# Altium schematic sheet POWER.SchDoc
size A4; SheetNumber: 4; SheetTotal: 7
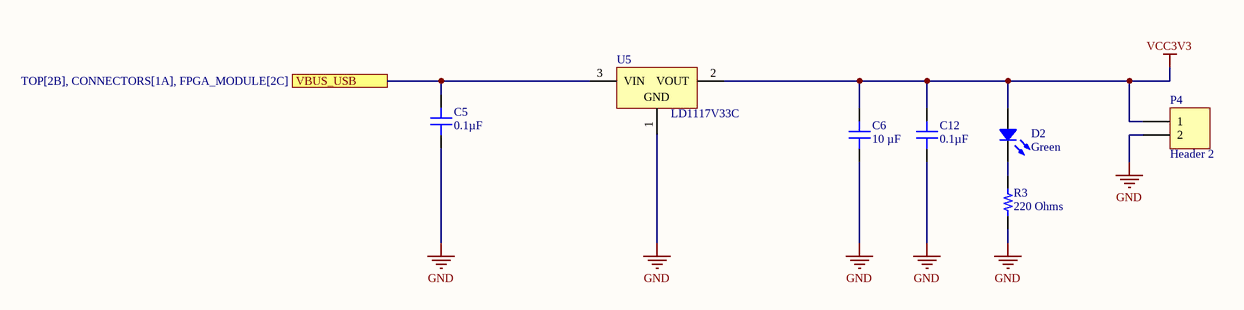
[diagram p0: POWER.SchDoc]

## Parts
C5  0.1µF  [CAP 0402_1005]
C6  10 µF  [CAP 1206_3216 - 0.8MM]
C12  0.1µF  [CAP 0402_1005]
D2  Green  [LED 1206_3216 GREEN]
P4  Header 2  [HDR1X2]
R3  220 Ohms  [RES 0402_1005]
U5  LD1117V33C  [TO220]

## Ports
VBUS_USB (see TOP[2B], CONNECTORS[1A], FPGA_MODULE[2C])

## Nets
GND: C5.1 C6.1 C12.1 P4.2 R3.1 U5.1(GND)
VCC3V3: C6.2 C12.2 D2.1 P4.1 U5.2(VOUT)
VBUS_USB: C5.2 U5.3(VIN) ; port VBUS_USB
NetD2_2: D2.2 R3.2

## Library data of the parts
C5 C12 = 0402ZC104KAT2A: CAP CER 0.1UF 10V X7R 0402; manufacturer: AVX Corporation; Tolerance: ±10%; Part Number: 0402ZC104KAT2A; Value: 0.1µF; Applications: General Purpose; Capacitance: 0.1µF; componentlink1description: Datasheet; componentlink1url: http://datasheets.avx.com/X7RDielectric.pdf; componentlink2description: DigiKey Link; componentlink2url: http://digikey.com/product-detail/en/avx-corporation/0402ZC104KAT2A/478-7891-1-ND/3881514; Device Package: 0402 (1005 Metric); lastupdated: 2022-02-08 12:26:59 PM; Lifecycle Status: Active; Minimum Order: 1; Mounting Type: Surface Mount, MLCC; Operating Temperature: -55°C ~ 125°C; Package / Case: 0402 (1005 Metric); packaging: TapeAndReel; partid: 1757; Part Status: Active; price: 0.09; series: -; Size / Dimension: 0.039" L x 0.020" W (1.00mm x 0.50mm); Supplier 1: DigiKey; Supplier Part Number 1: 478-7891-1-ND; Temperature Coefficient: X7R; Thickness (Max): 0.022" (0.55mm); Voltage - Rated: 10V
C6 = EMK316BJ106MD-T: CAP CER 10UF 16V X5R 1206; manufacturer: Taiyo Yuden; Tolerance: ±20%; Part Number: EMK316BJ106MD-T; Value: 10 µF; Applications: SMPS Filtering; Capacitance: 10 µF; componentlink1description: Datasheet; componentlink1url: http://www.yuden.co.jp/productdata/catalog/mlcc06_e.pdf; componentlink2description: DigiKey Link; componentlink2url: https://www.digikey.com/en/products/detail/taiyo-yuden/EMK316BJ106MD-T/6563474; Device Package: 1206 (3216 Metric); lastupdated: 2022-07-15 11:34:50 AM; Lifecycle Status: Active; Minimum Order: 1; Mounting Type: Surface Mount, MLCC; Operating Temperature: -55°C ~ 85°C; Package / Case: 1206 (3216 Metric); packaging: TapeAndReel; partid: 18996; Part Status: Active; price: 0.07; series: M; Size / Dimension: 0.126" L x 0.063" W (3.20mm x 1.60mm); Supplier 1: DigiKey; Supplier Part Number 1: 587-4881-1-ND; Temperature Coefficient: X5R; Thickness (Max): 0.037" (0.95mm); Voltage - Rated: 16V
D2 = APTL3216ZGCK-01: LED SMD; Manufacturer: Kingbright; Configuration: 1206; Current - Test: 20mA; Lens Color: Colorless; Lens Size: 1.10mm Dia; Lens Style: Round with Domed Top; Lens Transparency: Clear; Millicandela Rating: 1000mcd; Viewing Angle: 80°; Voltage - Forward (Vf) (Typ): 3.3V; Wavelength - Dominant: 525nm; Wavelength - Peak: 515nm; Part Number: APTL3216ZGCK-01; Color: Green; ComponentLink1Description: Datasheet; ComponentLink1URL: http://www.kingbrightusa.com/images/catalog/SPEC/APTL3216ZGCK-01.pdf; ComponentLink2Description: DigiKey Link; ComponentLink2URL: https://www.digikey.com/en/products/detail/kingbright/APTL3216ZGCK-01/10293089; Device Package: 1206 (3216 Metric); Height (Max): 1.20mm; LastUpdated: 2022-07-15 12:08:33 PM; Lifecycle Status: Active; Minimum Order: 1; Mounting Type: Surface Mount; Package / Case: 1206 (3216 Metric); Packaging: TapeAndReel; PartId: 546; Part Status: Active; Price: 0.18; Series: Heli-R; Size / Dimension: 3.20mm L x 1.60mm W; Supplier 1: DigiKey; Supplier Part Number 1: 754-APTL3216ZGCK-01CT-ND; Supplier Device Package: 1206; Value: Green
P4 = Header 2: Header, 2-Pin; LatestRevisionDate: 17-Jul-2002; LatestRevisionNote: Re-released for DXP Platform.; Publisher: Altium Limited
R3 = CRGP0402F220R: RES 220 OHM 1% 1/8W 0402; Manufacturer: TE Connectivity Passive Product; Power (Watts): 0.125W, 1/8W; Temperature Coefficient: ±100ppm/°C; Part Number: CRGP0402F220R; Value: 220 Ohms; ComponentLink1Description: Datasheet; ComponentLink1URL: https://www.te.com/commerce/DocumentDelivery/DDEController?Action=srchrtrv&DocNm=9-1773463-9&DocType=DS&DocLang=English; ComponentLink2Description: DigiKey Link; ComponentLink2URL: https://www.digikey.com/en/products/detail/te-connectivity-passive-product/CRGP0402F220R/8576949; Composition: Thick Film; Device Package: 0402 (1005 Metric); Features: Pulse Withstanding; Height - Seated (Max): 0.016" (0.40mm); LastUpdated: 2022-07-15 11:43:01 AM; Lifecycle Status: Active; Minimum Order: 1; Number of Terminations: 2; Operating Temperature: -55°C ~ 155°C; Package / Case: 0402 (1005 Metric); Packaging: TapeAndReel; PartId: 6226; Part Status: Active; Price: 0.01; Resistance: 220 Ohms; Series: CRGP; Size / Dimension: 0.043" L x 0.020" W (1.10mm x 0.50mm); Supplier 1: DigiKey; Supplier Part Number 1: A130347CT-ND; Supplier Device Package: 0402; Tolerance: ±1%
U5 = CMP-0244-00471-1: Fixed Low Drop Positive Voltage Regulator, 3.3V, 3-Pin TO-220; ComponentLink1URL: http://www.st.com; ComponentLink1Description: Manufacturer URL; PackageDescription: TO, Thru-Hole, Vertical, Heatsink Mounted; 3 In-Line Leads; Pitch 2.54 mm; ComponentLink2URL: http://www.st.com/internet/com/TECHNICAL_RESOURCES/TECHNICAL_LITERATURE/DATASHEET/CD00000544.pdf; PackageVersion: ver3.0; ComponentLink2Description: Datasheet; ComponentLink3URL: http://www.st.com/internet/com/TECHNICAL_RESOURCES/TECHNICAL_LITERATURE/PACKAGE_INFORMATION/CD00004649.pdf; ComponentLink3Description: Package Specification; PackageReference: TO220; DatasheetVersion: 1/11/2011